# Altium schematic sheet PMIC_1V2_3V3AUX.SchDoc: 1.2V and 3.3V Auxiliary Power Supply
size B; Author: Jordan Harris-Toovy; Revision: 0.1; SheetNumber: 14; SheetTotal: 22; Size: ANSI B
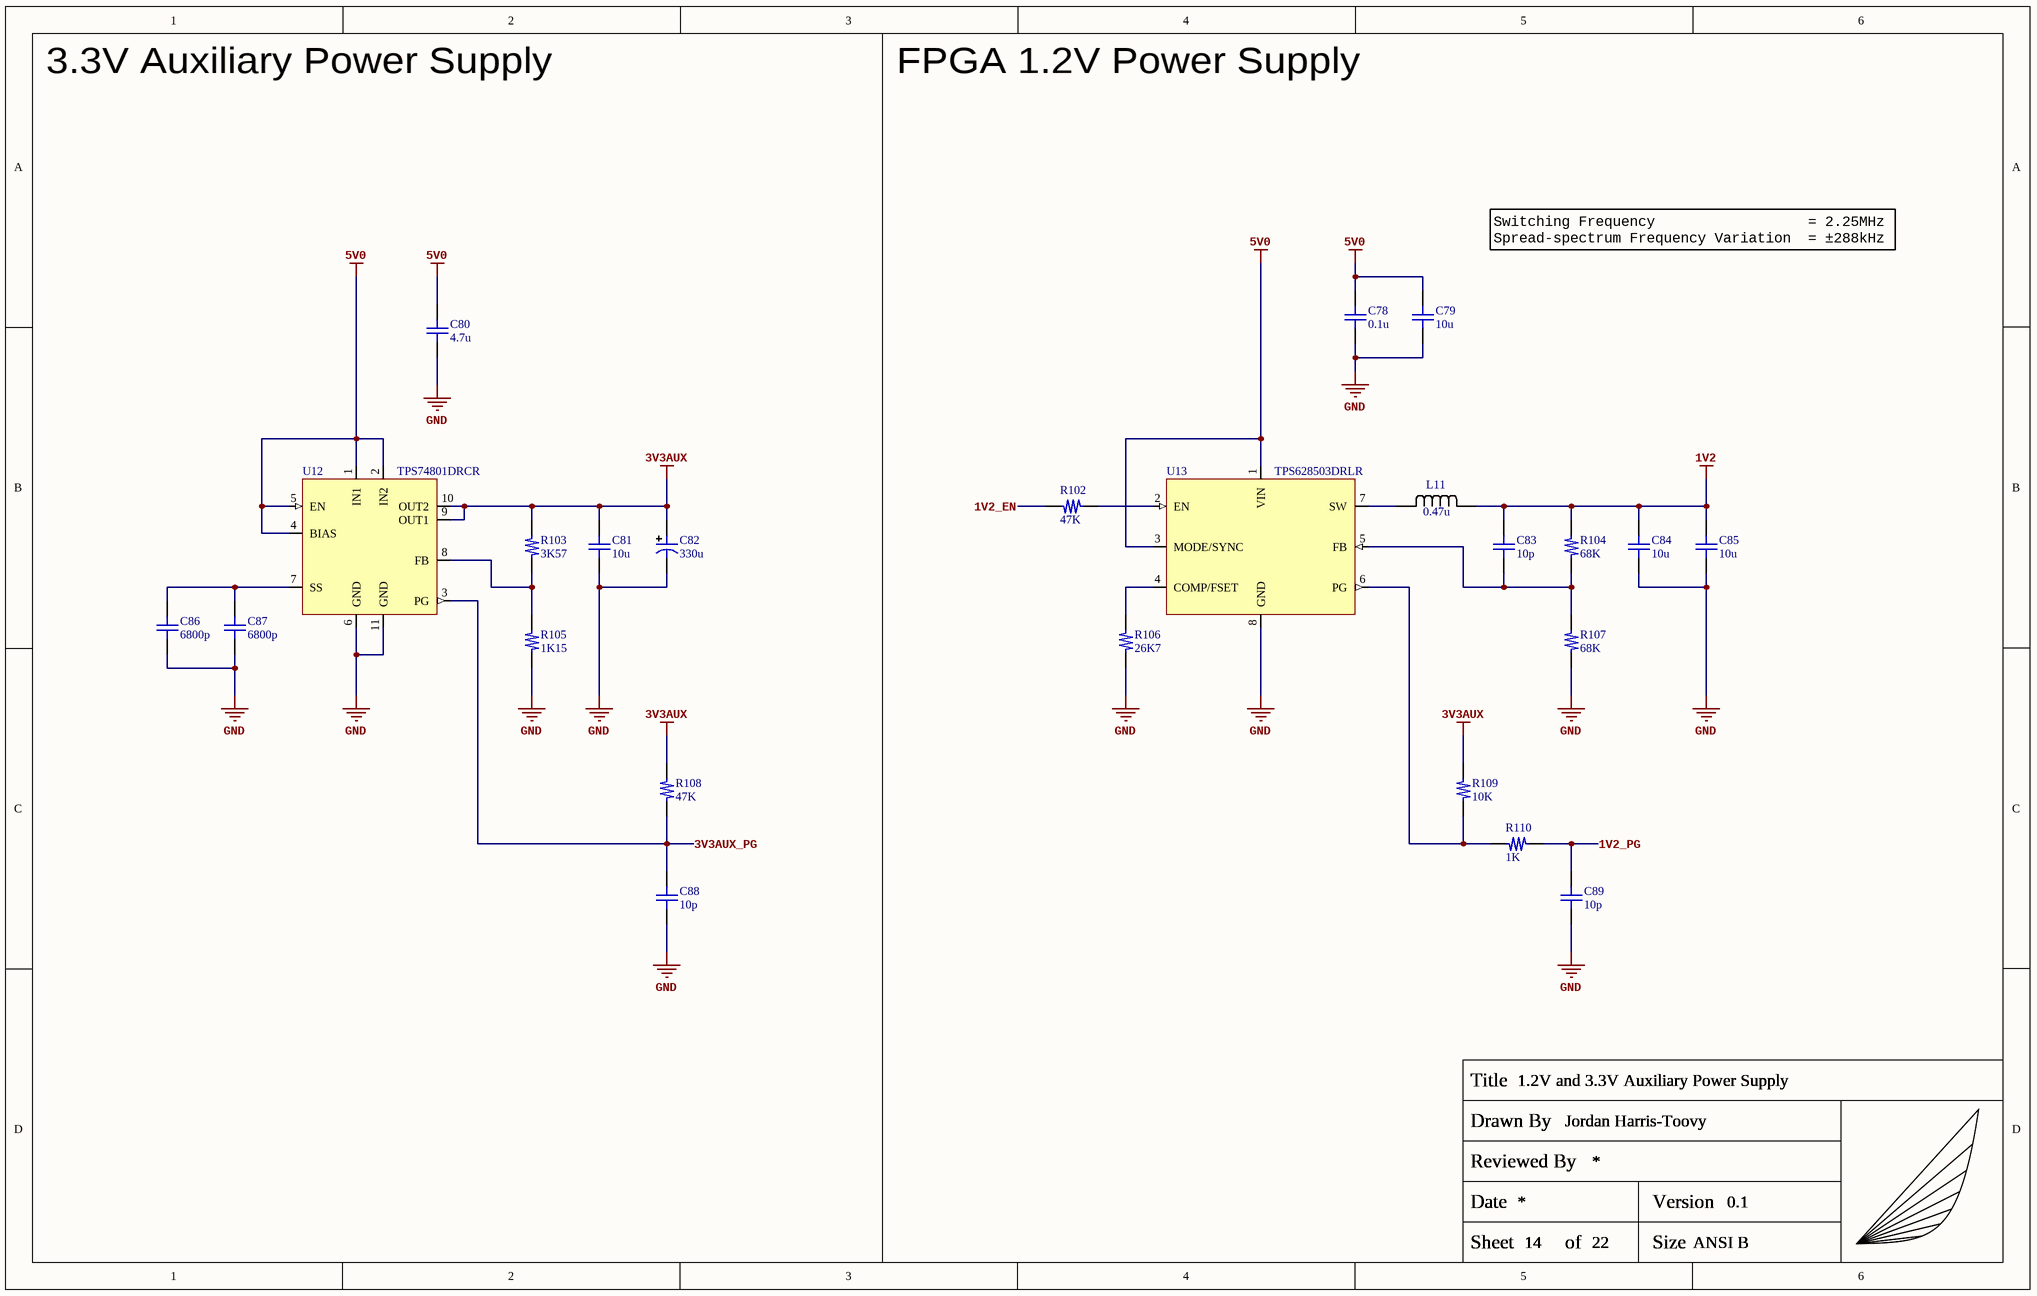
[diagram p0: PMIC_1V2_3V3AUX.SchDoc]

## Parts
C78  0.1u  [C_0402_Generic]
C79  10u  [C_0402_Generic]
C80  4.7u  [C_0402_Generic]
C81  10u  [C_0402_Generic]
C82  330u  [KEMET_EK_Radial]
C83  10p  [C_0402_Generic]
C84  10u  [C_0402_Generic]
C85  10u  [C_0402_Generic]
C86  6800p  [C_0402_Generic]
C87  6800p  [C_0402_Generic]
C88  10p  [C_0402_Generic]
C89  10p  [C_0402_Generic]
L11  0.47u  [ABRACON_0907_L]
R102  47K  [R_0402_Generic]
R103  3K57  [R_0402_Generic]
R104  68K  [R_0402_Generic]
R105  1K15  [R_0402_Generic]
R106  26K7  [R_0402_Generic]
R107  68K  [R_0402_Generic]
R108  47K  [R_0402_Generic]
R109  10K  [R_0402_Generic]
R110  1K  [R_0402_Generic]
TITLEBLOCK?  Capstone_Title_Block  (value not drawn)  (graphical)
U12  TPS74801DRCR  [TI_10VSON_DRC0010J_ADDVIA]
U13  TPS628503DRLR  [TI_SOT-583_DRL0008A]

## Nets
1V2: C83.2 C84.2 C85.2 L11.2(P2) R104.2
3V3AUX: C81.2 C82.1 R103.2 R108.2 R109.2 U12.9(OUT1) U12.10(OUT2)
5V0: C78.2 C79.2 C80.2 U12.1(IN1) U12.2(IN2) U12.4(BIAS) U12.5(EN) U13.1(VIN) U13.3(MODE/SYNC)
GND: C78.1 C79.1 C80.1 C81.1 C82.2 C84.1 C85.1 C86.1 C87.1 C88.1 C89.1 R105.1 R106.1 R107.1 U12.6(GND) U12.11(GND) U13.8(GND)
1V2_EN: R102.2
1V2_PG: C89.2 R110.1
3V3AUX_PG: C88.2 R108.1 U12.3(PG)
NetC83_1: C83.1 R104.1 R107.2 U13.5(FB)
NetC86_2: C86.2 C87.2 U12.7(SS)
NetL11_1: L11.1(P1) U13.7(SW)
NetR102_1: R102.1 U13.2(EN)
NetR103_1: R103.1 R105.2 U12.8(FB)
NetR106_2: R106.2 U13.4(COMP/FSET)
NetR109_1: R109.1 R110.2 U13.6(PG)

## Notes on the sheet
- 3.3V Auxiliary Power Supply
- FPGA 1.2V Power Supply
- Switching Frequency                  = 2.25MHz
  Spread-spectrum Frequency Variation  = ±288kHz
- (in symbol Capstone_Title_Block) Title; Drawn By; Reviewed By; Date; Version; Sheet; of; Size

## Library data of the parts
C78 = GRM155R71C104KA88D: 0.1µF 16V X7R SMD ceramic capacitor in 0402 size; Manufacturer: Murata Electronics; Manufacturer Part Number: GRM155R71C104KA88D
C79 C81 C84 C85 = CC0402MRX5R6BB106: 10µF 10V X5R SMD ceramic capacitor in 0402 size; Manufacturer: YAGEO; Manufacturer Part Number: CC0402MRX5R6BB106
C80 = GRM155R61A475MEAAJ: 4.7µF 10V X5R SMD ceramic capacitor in 0402 size; Manufacturer: Murata Electronics; Manufacturer Part Number: GRM155R61A475MEAAJ
C82 = A759EK337M1AAAE018: 330µF 10V Aluminum polymer capacitor, KEMET EK; Manufacturer: KEMET; Manufacturer Part Number: A759EK337M1AAAE018
C83 C88 C89 = GRM1555C1H100JA01D: 10pF 50V C0G/NP0 SMD ceramic capacitor in 0402 size; Manufacturer: Murata Electronics; Manufacturer Part Number: GRM1555C1H100JA01D
C86 C87 = GRM155R71E682KA01D: 6800pF 25V X7R SMD ceramic capacitor in 0402 size; Manufacturer: Murata Electronics; Manufacturer Part Number: GRM155R71E682KA01D
L11 = AOTA-B252010SR47MT: Inductor 0.47uH 5.7A 20mOhm, 1008 (2520 Metric); Manufacturer: Abracon; Manufacturer Part Number: AOTA-B252010SR47MT
R102 R108 = ERJ-2RKF4702X: 47KOhm 1% 1/10W SMD resistor in 0402 size; Manufacturer: Panasonic; Manufacturer Part Number: ERJ-2RKF4702X
R103 = ERJ-2RKF3571X: 3.57KOhm 1% 1/10W SMD resistor in 0402 size; Manufacturer: Panasonic; Manufacturer Part Number: ERJ-2RKF3571X
R104 R107 = ERJ-2RKF6802X: 68KOhm 1% 1/10W SMD resistor in 0402 size; Manufacturer: Panasonic; Manufacturer Part Number: ERJ-2RKF6802X
R105 = ERJ-2RKF1151X: 1.15KOhm 1% 1/10W SMD resistor in 0402 size; Manufacturer: Panasonic; Manufacturer Part Number: ERJ-2RKF1151X
R106 = ERJ-2RKF2672X: 26.7KOhm 1% 1/10W SMD resistor in 0402 size; Manufacturer: Panasonic; Manufacturer Part Number: ERJ-2RKF2672X
R109 = ERJ-2RKF1002X: 10KOhm 1% 1/10W SMD resistor in 0402 size; Manufacturer: Panasonic; Manufacturer Part Number: ERJ-2RKF1002X
R110 = ERJ-2RKF1001X: 1KOhm 1% 1/10W SMD resistor in 0402 size; Manufacturer: Panasonic; Manufacturer Part Number: ERJ-2RKF1001X
TITLEBLOCK? = Capstone_Title_Block: Custom title block with personal logo; Manufacturer: NONE; Manufacturer Part Number: NONE
U12 = TPS74801DRCR: LDO 1.5A 10-VSON; Manufacturer: Texas Instruments; Manufacturer Part Number: TPS74801DRCR
U13 = TPS628503DRLR: Buck Switching Regulator 3A; Manufacturer: Texas Instruments; Manufacturer Part Number: TPS628503DRLR